# EAGLE design SparkFun_Photon_Weather_Shield (EAGLE 7.6.0)
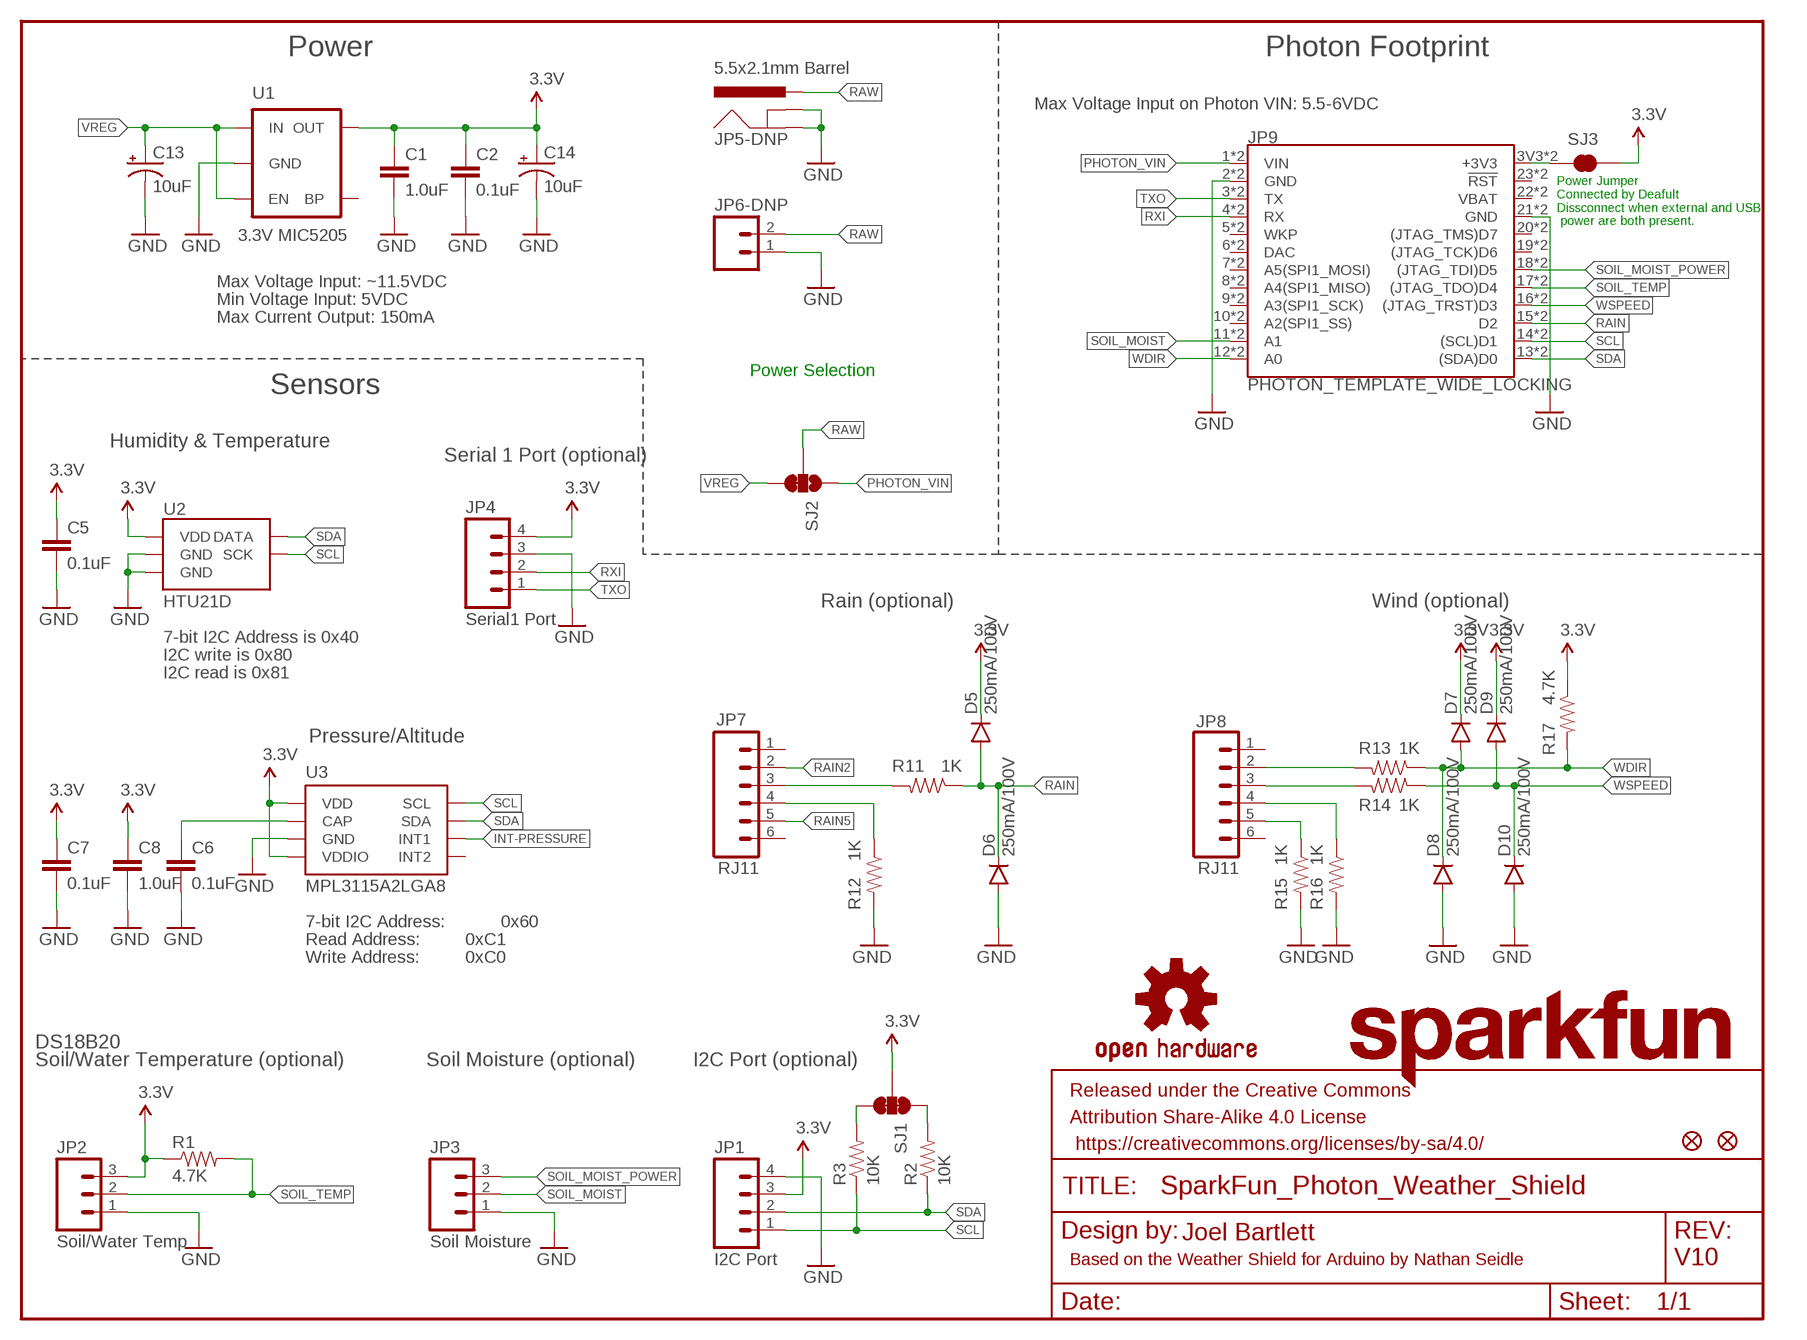
[diagram p0: schematic, sheet 1]

## Parts
C1  1.0uF  1.0UF-16V-10%(0603)  [0603-CAP]
C2  0.1uF  0.1UF-25V(+80/-20%)(0603)  [0603-CAP]
C5  0.1uF  0.1UF-25V(+80/-20%)(0603)  [0603-CAP]
C6  0.1uF  0.1UF-25V(+80/-20%)(0603)  [0603-CAP]
C7  0.1uF  0.1UF-25V(+80/-20%)(0603)  [0603-CAP]
C8  1.0uF  1.0UF-16V-10%(0603)  [0603-CAP]
C13  10uF  10UF-16V-10%(TANT)  [EIA3216]
C14  10uF  10UF-16V-10%(TANT)  [EIA3216]
D5  250mA/100V  DIODEBAS16  [SOD-323]
D6  250mA/100V  DIODEBAS16  [SOD-323]
D7  250mA/100V  DIODEBAS16  [SOD-323]
D8  250mA/100V  DIODEBAS16  [SOD-323]
D9  250mA/100V  DIODEBAS16  [SOD-323]
D10  250mA/100V  DIODEBAS16  [SOD-323]
FID1  FIDUCIAL1X2  [FIDUCIAL-1X2]
FID2  FIDUCIAL1X2  [FIDUCIAL-1X2]
FRAME1  FRAME-LETTER  [CREATIVE_COMMONS]
JP1  I2C Port  M04PTH  [1X04]
JP2  Soil/Water Temp  M03PTH  [1X03]
JP3  Soil Moisture  M03PTH  [1X03]
JP4  Serial1 Port  M04PTH  [1X04]
JP5-DNP  5.5x2.1mm Barrel  POWER_JACKSMD  [POWER_JACK_SMD]
JP6-DNP  M023.5MM  [SCREWTERMINAL-3.5MM-2]
JP7  RJ11  RJ11-6PTH  [RJ11-6]
JP8  RJ11  RJ11-6PTH  [RJ11-6]
JP9  PHOTON_TEMPLATE_WIDE_LOCKING  SPARK_PHOTONSPARK_PHOTON_TEMPLATE_WIDE_LOCKING  [SPARK_PHOTON_TEMPLATE_WIDE_LOCKING]
LOGO1  OSHW-LOGOM  [OSHW-LOGO-M]
LOGO2  SFE_LOGO_NAME.1_INCH  [SFE_LOGO_NAME_.1]
R1  4.7K  4.7KOHM-1/10W-1%(0603)  [0603-RES]
R2  10K  10KOHM-1/10W-1%(0603)0603  [0603-RES]
R3  10K  10KOHM-1/10W-1%(0603)0603  [0603-RES]
R11  1K  1KOHM-1/10W-1%(0603)  [0603-RES]
R12  1K  1KOHM-1/10W-1%(0603)  [0603-RES]
R13  1K  1KOHM-1/10W-1%(0603)  [0603-RES]
R14  1K  1KOHM-1/10W-1%(0603)  [0603-RES]
R15  1K  1KOHM-1/10W-1%(0603)  [0603-RES]
R16  1K  1KOHM-1/10W-1%(0603)  [0603-RES]
R17  4.7K  4.7KOHM-1/10W-1%(0603)  [0603-RES]
SJ1  JUMPER-PAD-3-NC_BY_TRACE  [PAD-JUMPER-3-3OF3_NC_BY_TRACE_YES_SILK_FULL_BOX]
SJ2  JUMPER-PAD-3-2OF3_NC_BY_TRACE_SMALL  [PAD-JUMPER-3-2OF3_NC_BY_TRACE_YES_SILK_FULL_BOX]
SJ3  JUMPER-PAD-2-NC_BY_TRACE  [PAD-JUMPER-2-NC_BY_TRACE_YES_SILK]
U1  3.3V MIC5205  MIC52053.3V  [SOT23-5]
U2  HTU21D  HTU21DSMD  [HTU21D]
U3  MPL3115A2LGA8  [LGA8]

## Nets
3.3V: C1.1 C2.1 C5.1 C7.1 C8.1 C14.A(+) D5.C D7.C D9.C JP1.3 JP2.3 JP4.4 R1.1 R17.1 SJ1.2 SJ3.2 U1.5(OUT) U2.VDD U3.1(VDD) U3.4(VDDIO)
GND: C1.2 C2.2 C5.2 C6.2 C7.2 C8.2 C13.C(-) C14.C(-) D6.A D8.A D10.A JP1.4 JP2.1 JP3.1 JP4.3 JP5-DNP.GND(GNDBREAK) JP5-DNP.P$4(GND) JP6-DNP.1 JP9.2(GND) JP9.21(GND) JP9.GND@0(GND) JP9.GND@2(GND) R12.2 R15.2 R16.2 U1.2(GND) U2.7(GND) U2.GND U3.3(GND)
INT-PRESSURE: U3.6(INT1)
N$1: JP8.3 R14.2
N$2: JP8.2 R13.2
N$3: R3.2 SJ1.3
N$4: JP7.3 R11.2
N$5: C6.1 U3.2(CAP)
N$6: R2.2 SJ1.1
N$7: JP9.3V3(+3V3) JP9.24(+3V3) SJ3.1
N$11: JP7.4 R12.1
N$12: JP8.5 R15.1
N$13: JP8.4 R16.1
PHOTON_VIN: JP9.1(VIN) JP9.VIN SJ2.1
RAIN: D5.A D6.C JP9.15(D2) JP9.D2 R11.1
RAIN2: JP7.2
RAIN5: JP7.5
RAW [vcc]: JP5-DNP.VIN0(PWR) JP6-DNP.2 SJ2.2
RXI: JP4.2 JP9.4(RX) JP9.RX
SCL: JP1.1 JP9.14((SCL)D1) JP9.D1((SCL)D1) R3.1 U2.SCK U3.8(SCL)
SDA: JP1.2 JP9.13((SDA)D0) JP9.D0((SDA)D0) R2.1 U2.DATA U3.7(SDA)
SOIL_MOIST: JP3.2 JP9.11(A1) JP9.A1
SOIL_MOIST_POWER: JP3.3 JP9.18((JTAG_TDI)D5) JP9.D5((JTAG_TDI)D5)
SOIL_TEMP: JP2.2 JP9.17((JTAG_TDO)D4) JP9.D4((JTAG_TDO)D4) R1.2
TXO: JP4.1 JP9.3(TX) JP9.TX
VREG: C13.A(+) SJ2.3 U1.1(IN) U1.3(EN)
WDIR: D7.A D8.C JP9.12(A0) JP9.A0 R13.1 R17.2
WSPEED: D9.A D10.C JP9.16((JTAG_TRST)D3) JP9.D3((JTAG_TRST)D3) R14.1
Unconnected: JP7.1 JP7.6 JP8.1 JP8.6 JP9.5(WKP) JP9.6(DAC) JP9.7(A5(SPI1_MOSI)) JP9.8(A4(SPI1_MISO)) JP9.9(A3(SPI1_SCK)) JP9.10(A2(SPI1_SS)) JP9.19((JTAG_TCK)D6) JP9.20((JTAG_TMS)D7) JP9.22(VBAT) JP9.23(!RST!) JP9.A2(A2(SPI1_SS)) JP9.A3(A3(SPI1_SCK)) JP9.A4(A4(SPI1_MISO)) JP9.A5(A5(SPI1_MOSI)) JP9.D6((JTAG_TCK)D6) JP9.D7((JTAG_TMS)D7) JP9.DAC JP9.RST(!RST!) JP9.VBAT JP9.WKP U1.4(BP) U3.5(INT2)

## Notes on the sheet
- Power | Photon Footprint
- Max Voltage Input on Photon VIN: 5.5-6VDC
- Power Jumper
  Connected by Deafult
  Dissconnect when external and USB
   power are both present.
- Max Voltage Input: ~11.5VDC
- Min Voltage Input: 5VDC
- Max Current Output: 150mA
- Power Selection
- Sensors
- Humidity & Temperature
- Serial 1 Port (optional)
- Rain (optional) | Wind (optional)
- 7-bit I2C Address is 0x40
- I2C write is 0x80
- I2C read is 0x81
- Pressure/Altitude
- 7-bit I2C Address: | 0x60
- Read Address: | 0xC1
- Write Address: | 0xC0
- DS18B20
- Soil/Water Temperature (optional) | Soil Moisture (optional) | I2C Port (optional)
- Joel Bartlett
- Based on the Weather Shield for Arduino by Nathan Seidle | V10

## Library data of the parts
C1 C8 = SparkFun-Capacitors:1.0UF-16V-10%(0603): CAP-00868; PROD_ID: CAP-00868
C2 C5-C7 = SparkFun-Capacitors:0.1UF-25V(+80/-20%)(0603): CAP-00810 Ceramic Standard decoupling cap; PROD_ID: CAP-00810
C13 C14 = SparkFun-Capacitors:10UF-16V-10%(TANT): CAP-00811 1206/EIA-3216 Tantalum capacitor; PROD_ID: CAP-00811
D5-D10 = SparkFun-DiscreteSemi:DIODE: Diode These are standard reverse protection diodes and small signal diodes. SMA package can handle up to about 1A. SOD-323 can handle about 200mA. What the SOD-323 package when ordering, there are some mfgs out there that are 5-pin packages.; PROD_ID: DIO-09646
FID1 FID2 = SparkFun-Aesthetics:FIDUCIAL: Fiducial Alignment Points Various fiducial points for machine vision alignment.
FRAME1 = SparkFun-Aesthetics:FRAME-LETTER: Schematic Frame Standard 8.5x11 US Letter frame
JP1 JP4 = SparkFun-Connectors:M04: Header 4 Standard 4-pin 0.1" header. Use with straight break away headers (SKU : PRT-00116), right angle break away headers (PRT-00553), swiss pins (PRT-00743), machine pins (PRT-00117), and female headers (PRT-00115). Molex polarized connector foot print use with SKU : PRT-08231 with associated crimp pins and housings. 1MM SMD Version SKU: PRT-10208
JP2 JP3 = SparkFun-Connectors:M03: Header 3 Standard 3-pin 0.1" header. Use with straight break away headers (SKU : PRT-00116), right angle break away headers (PRT-00553), swiss pins (PRT-00743), machine pins (PRT-00117), and female headers (PRT-00115). Molex polarized connector foot print use with SKU : PRT-08232 with associated crimp pins and housings.
JP5-DNP = SparkFun-Connectors:POWER_JACK: Power Jack This is the standard 5.5mm barrel jack for power. The PTH is the most common, proven, reliable, footprint. The Slot footprint only works if the mill layer is transmitted to the PCB fab house so be warned. Mating wall wart : TOL-00298 (and others); PROD_ID: CONN-08106; SF_ID: PRT-12748
JP6-DNP = SparkFun-Connectors:M02: Standard 2-pin 0.1" header. Use with - straight break away headers ( PRT-00116) - right angle break away headers (PRT-00553) - swiss pins (PRT-00743) - machine pins (PRT-00117) - female headers (PRT-00115) Molex polarized connector foot print use with: PRT-08233 with associated crimp pins and housings. 2.54_SCREWTERM for use with PRT-10571. 3.5mm Screw Terminal footprints for PRT-08084 5mm Screw Terminal footprints for use with PRT-08432; PROD_ID: CONN-08399
JP7 JP8 = SparkFun-Connectors:RJ11-6: RJ11 Jack Simple 6 pin RJ11 jack. Commonly found on CAT3 devices and Microchip programmers. SKU: PRT-00132; PROD_ID: CONN-08590
JP9 = template_temp:SPARK_PHOTON
LOGO1 = SparkFun-Aesthetics:OSHW-LOGO: Open Source Hardware Logo This logo indicates the piece of hardware it is found on incorporates a OSHW license and/or adheres to the definition of open source hardware found here: http://freedomdefined.org/OSHW
LOGO2 = SparkFun-Aesthetics:SFE_LOGO_NAME: SFE Logo, name only This is the SparkFun name logo. The logo on the schematic will always be the same size; the package variant is the height of the flame part of the logo (or the height the flame would be, if it were drawn). Default layer for the logo on the board is tSilk.
R1 R17 = SparkFun-Resistors:4.7KOHM-1/10W-1%(0603): RES-07857; PROD_ID: RES-07857
R2 R3 = SparkFun-Resistors:10KOHM-1/10W-1%(0603): RES-00824; PROD_ID: RES-00824
R11-R16 = SparkFun-Resistors:1KOHM-1/10W-1%(0603): RES-07856; PROD_ID: RES-07856
SJ1 = SparkFun-Passives:JUMPER-PAD-3-NC_BY_TRACE
SJ2 = SparkFun-Passives:JUMPER-PAD-3-2OF3_NC_BY_TRACE
SJ3 = SparkFun-Passives:JUMPER-PAD-2-NC_BY_TRACE
U1 = SparkFun-PowerIC:MIC5205: MIC5205 150mA vreg 3.3V - VREG-00822 5V - VREG-00823; PROD_ID: VREG-00822
U2 = SparkFun-Sensors:HTU21D; PROD_ID: IC-11793
U3 = SparkFun-Sensors:MPL3115A2: Altimeter/Pressure Sensor, I2C, 1.95V-3.6V supply, 50 to 110kPa; PROD_ID: IC-10869

## Net classes
0 Default: width 0.203 mm
1 vcc: width 0.203 mm

## Board
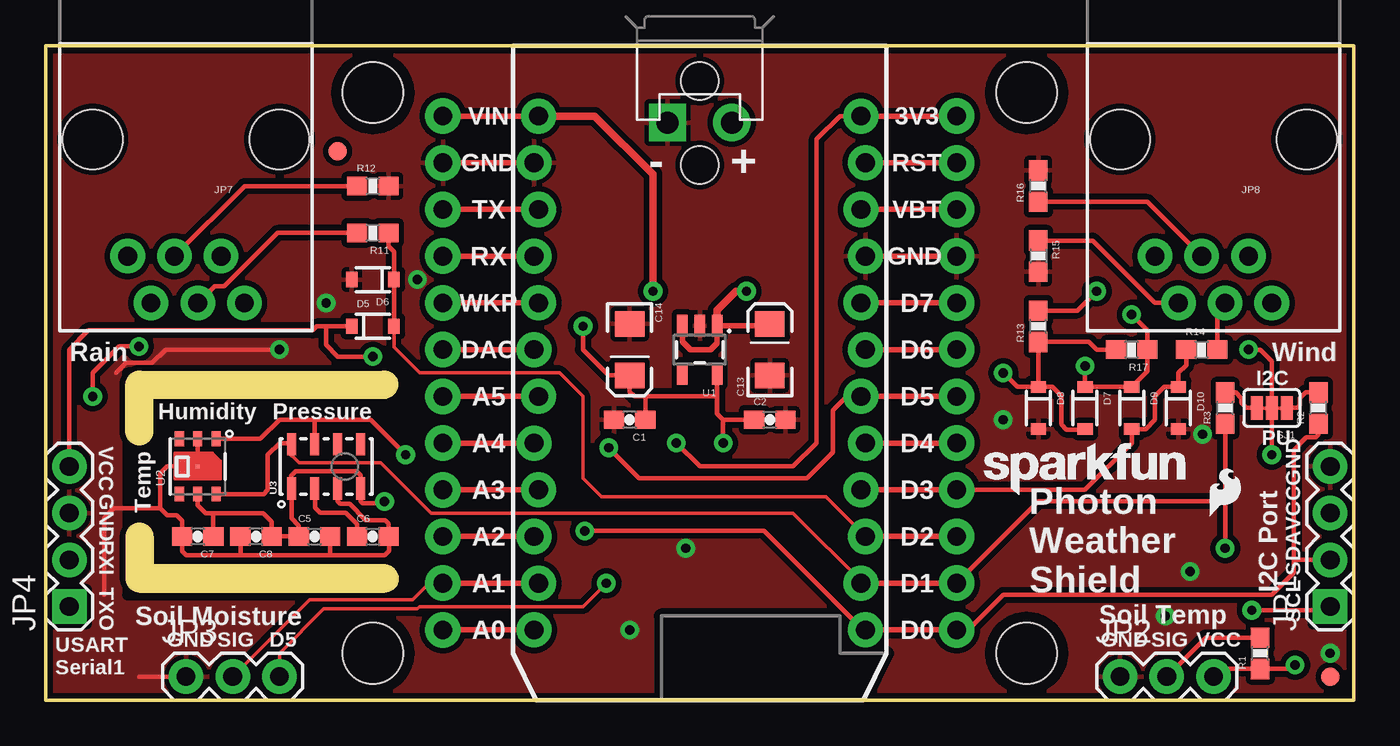
[diagram p1: board, top side]
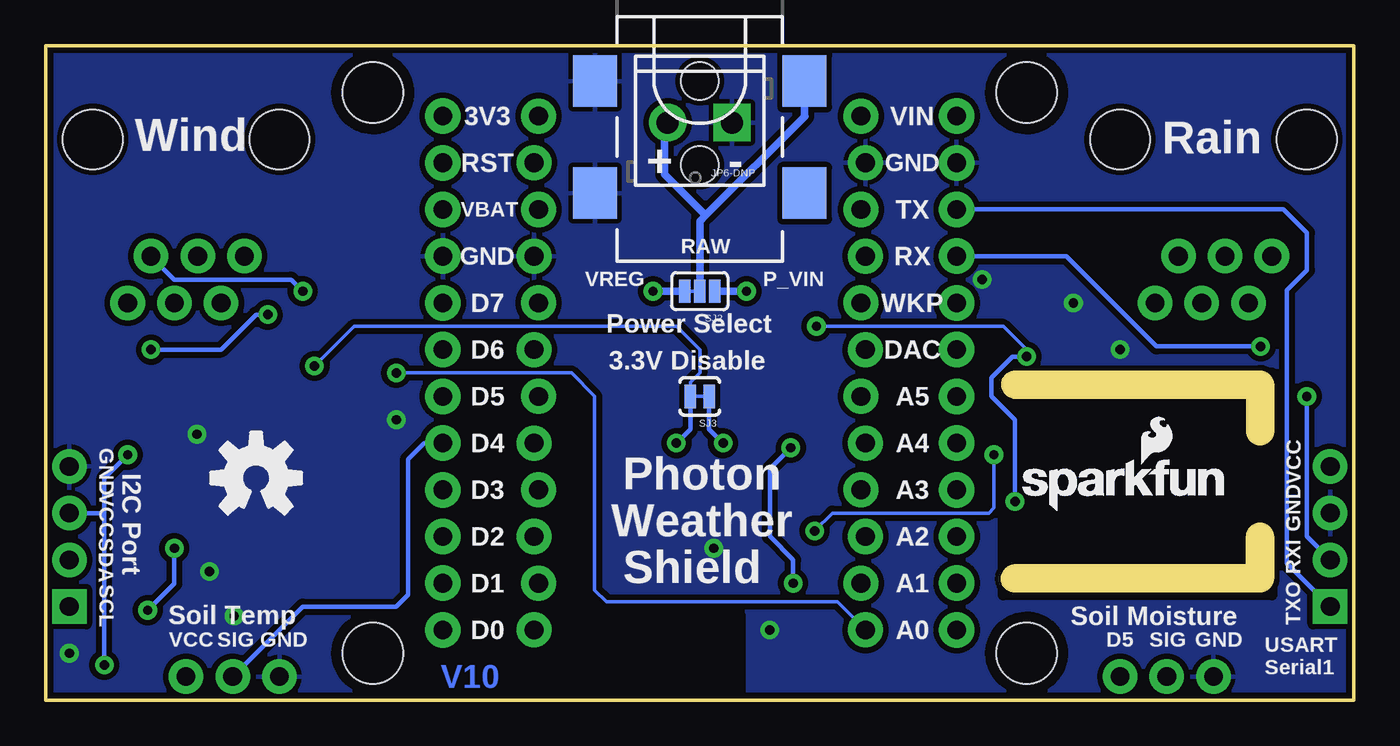
[diagram p2: board, bottom side, seen from below]

Size 71.12 x 35.56 mm. Coordinates in mm from the lower left corner, seen from the top.
Outline: 0,0 0,35.56 71.12,35.56 71.12,0 0,0
Outline: 4.39,17.09 4.39,14.63 arc90 5.08,13.95 arc90 5.74,14.61 5.74,16.46 18.36,16.46 arc90 19.07,17.17 arc90 18.44,17.8 5.11,17.8 arc90 4.39,17.09
Outline: 4.42,6.66 4.42,8.87 arc-90 5.11,9.55 arc-90 5.77,8.87 5.77,7.29 18.39,7.29 arc-90 19.1,6.58 arc-90 18.47,5.94 5.13,5.94 arc-90 4.42,6.66
Copper layers (1*16): Top 0.035mm / dielectric 1.5mm / Bottom 0.035mm
Design rules "SparkFun-2-layer": minimum track width 7mil, minimum drill 15mil, track to track 8mil, track to pad 8mil, pad to pad 8mil, via to via 8mil, smd to smd 8mil, copper to edge 8mil, drill to drill 8mil, minimum pad ring 12mil, minimum via ring 10mil, stop-mask expansion 4mil, vias tented up to drill 20mil, thermal gap 10mil
tRestrict: area 4.4,5.7 to 19.1,17.8
bRestrict: area 4.4,5.7 to 19.1,17.8
Milling: 4 lines

### Footprints (pad centres in the part's own frame; a part is rotated, then mirrored left to right if it is on the bottom)
0603-CAP = smd 1.1 x 1: 1 -0.85,0; 2 0.85,0
EIA3216 = smd 1.4 x 1.6: A 1.4,0; C -1.4,0
SOD-323 = smd 0.63 x 0.83: A 1.15,0; C -1.15,0
FIDUCIAL-1X2 = smd 1 x 1: 1 0,0
1X04 = drill 1.016 pad 1.88 square: 1 0,0 | drill 1.016 pad 1.88: 2 2.54,0; 3 5.08,0; 4 7.62,0
1X03 = drill 1.016 pad 1.88: 1 0,0; 2 2.54,0; 3 5.08,0
POWER_JACK_SMD = smd 2.8 x 2.4: GND 0,-5.7; P$4 6.1,-5.7; VIN0 0,5.7; VIN1 6.1,5.7 | hole 2.032: 0,0; 4.572,0
SCREWTERMINAL-3.5MM-2 = drill 1.2 pad 2.032 square: 1 0,0 | drill 1.2 pad 2.032: 2 3.5,0
RJ11-6 = drill 1.016 pad 1.88: 1 -3.175,8.89; 2 -1.905,6.35; 3 -0.635,8.89; 4 0.635,6.35; 5 1.905,8.89; 6 3.175,6.35 | hole 3.251: -5.08,0; 5.08,0
SPARK_PHOTON_TEMPLATE_WIDE_LOCKING = drill 1.016 pad 1.905: 1 1.397,31.75; 2 1.143,29.21; 3 1.397,26.67; 4 1.143,24.13; 5 1.397,21.59; 6 1.143,19.05; 7 1.397,16.51; 8 1.143,13.97; 9 1.397,11.43; 10 1.143,8.89; 11 1.397,6.35; 12 1.143,3.81; 13 19.177,3.81; 14 18.923,6.35; 15 19.177,8.89; 16 18.923,11.43; 17 19.177,13.97; 18 18.923,16.51; 19 19.177,19.05; 20 18.923,21.59; 21 19.177,24.13; 22 18.923,26.67; 23 19.177,29.21; 24 18.923,31.75 | drill 1.016 pad 1.93: 3V3 24.13,31.75; A0 -3.81,3.81; A1 -3.81,6.35; A2 -3.81,8.89; A3 -3.81,11.43; A4 -3.81,13.97; A5 -3.81,16.51; D0 24.13,3.81; D1 24.13,6.35; D2 24.13,8.89; D3 24.13,11.43; D4 24.13,13.97; D5 24.13,16.51; D6 24.13,19.05; D7 24.13,21.59; DAC -3.81,19.05; GND@0 -3.81,29.21; GND@2 24.13,24.13; RST 24.13,29.21; RX -3.81,24.13; TX -3.81,26.67; VBAT 24.13,26.67; VIN -3.81,31.75; WKP -3.81,21.59 | hole 3.302: -7.62,33.02; 27.94,33.02; -7.62,2.54; 27.94,2.54
0603-RES = smd 1.1 x 1: 1 -0.85,0; 2 0.85,0
PAD-JUMPER-3-3OF3_NC_BY_TRACE_YES_SILK_FULL_BOX = smd 0.635 x 1.27: 1 -0.813,0; 2 0,0; 3 0.813,0
PAD-JUMPER-3-2OF3_NC_BY_TRACE_YES_SILK_FULL_BOX = smd 0.635 x 1.27: 1 -0.813,0; 2 0,0; 3 0.813,0
PAD-JUMPER-2-NC_BY_TRACE_YES_SILK = smd 0.635 x 1.27: 1 -0.508,0; 2 0.508,0
SOT23-5 = smd 0.55 x 1.2: 1 -0.95,-1.3; 2 0,-1.3; 3 0.95,-1.3; 4 0.95,1.3; 5 -0.95,1.3
HTU21D = smd 0.2 x 0.2: 7 0,0 | smd 0.8 x 0.5: DATA 1.5,-1; GND 1.5,0; NC@1 -1.5,1; NC@6 1.5,1; SCK -1.5,-1; VDD -1.5,0
LGA8 = smd 1.2 x 0.5: 1 -1.2,1.875; 2 -1.2,0.625; 3 -1.2,-0.625; 4 -1.2,-1.875; 5 1.2,-1.875; 6 1.2,-0.625; 7 1.2,0.625; 8 1.2,1.875

### Placement (x,y rotation side)
C1  31.75,15.24 180 top
C2  39.37,15.24 0 top
C5  14.61,8.89 0 top
C6  17.78,8.89 0 top
C7  8.26,8.89 180 top
C8  11.43,8.89 180 top
C13  39.37,19.05 90 top
C14  31.75,19.05 270 top
D5  17.78,20.32 0 top
D6  17.78,22.86 180 top
D7  56.52,15.88 270 top
D8  53.98,15.88 270 top
D9  59.05,15.88 270 top
D10  61.59,15.88 270 top
FID1  69.85,1.27 0 top
FID2  15.88,29.84 0 top
FRAME1  7.62,-10.16 0 top  (outside the outline)
JP1  69.85,5.08 90 top
JP2  58.42,1.27 0 top
JP3  7.62,1.27 0 top
JP4  1.27,5.08 90 top
JP5-DNP  35.56,33.66 270 bottom
JP6-DNP  33.81,31.39 180 bottom
JP7  7.62,30.48 180 top
JP8  63.5,30.48 180 top
JP9  25.4,0 0 top
LOGO1  59.69,12.06 0 bottom
LOGO2  50.55,10.67 0 top
R1  66.04,2.54 90 top
R2  69.22,15.88 90 top
R3  64.14,15.88 90 top
R11  17.78,25.4 180 top
R12  17.78,27.94 0 top
R13  53.98,20.32 90 top
R14  62.87,19.05 0 top
R15  53.98,24.13 270 top
R16  53.98,27.94 90 top
R17  59.05,19.05 180 top
SJ1  66.67,15.88 180 top
SJ2  35.56,22.23 180 bottom
SJ3  35.56,16.51 180 bottom
U1  35.56,19.05 180 top
U2  8.26,12.7 90 top
U3  15.24,12.7 90 top
U$1  [SFE_LOGO_NAME_FLAME_.1]  18.41,10.19 0 bottom
U$3  [SFE_LOGO_FLAME_.1]  62.99,9.65 0 top

### Tracks (layer width: path | path; a pad name or v marks a point on that pad's centre or on a via)
3.3V  (via drill 0.51)
  Top 0.254: U2.VDD 8.26,10.59 8.69,10.16 9.11,10.16 | C7.1 9.11,9.18 | 9.11,10.16 C7.1 | U3.4 17.11,12.22 16.89,12.45 13.59,12.45 13.34,12.19 13.34,11.53 U3.1 13.37,9.88 13.76,9.49 C5.1 C8.1 12.28,9.69 11.81,10.16 9.11,10.16 | JP2.3 63.92,1.69 R1.1 67.73,1.69 v67.94,1.91 | 38.56,15.2 C2.1 36.83,15.24 | v56.52,18.16 D7.C D9.C 59.91,17.88 R17.1 59.91,20.11 v59.05,20.95 | v66.67,13.34 SJ1.2 66.67,18.41 66.04,19.05 v65.41,19.05 | 36.51,16.51 32.6,16.51 | 32.6,16.51 C1.1 | 32.6,16.51 32,16.51 31.75,16.76 C14.A 30.61,17.65 29.21,19.05 v29.21,20.32 | U1.5 36.51,16.51 | 36.51,16.51 36.51,15.56 36.83,15.24 | v36.83,13.97 36.83,15.24 | C7.1 9.11,9.74 | 17.14,11.47 U3.4 | v17.78,18.67 15.88,18.67 15.24,19.3 15.24,20.32 | U3.4 17.11,10.8 17.22,10.69 18.31,10.69 v18.41,10.79 | JP4.4 1.27,19.05 2.31,20.09 14.5,20.09 14.73,20.32 15.24,20.32 | D5.C 15.24,20.32
  Bottom 0.203: SJ3.2 36.07,17.27 35.56,17.78 35.56,19.05 36.83,20.32 54.36,20.32 v56.52,18.16 | v29.21,20.32 19.05,20.32 17.78,19.05 v17.78,18.67
  Bottom 0.254: v67.94,1.91 67.94,10.16 | 67.94,10.16 67.94,12.06 v66.67,13.34 | JP1.3 67.94,10.16 | v65.41,19.05 61.59,19.05 59.69,20.95 v59.05,20.95 | SJ3.2 36.07,14.73 v36.83,13.97 | v18.41,10.79 18.41,15.24 19.68,16.51 19.68,17.53 18.54,18.67 v17.78,18.67
GND  (via drill 0.51)
  Top 0.254: U3.3 15.87,10.8 16,10.67 16.51,10.67 17.4,9.78 18.44,9.78 18.63,9.59 C6.2 18.67,8.85 18.67,8.13 18.41,7.87 15.46,7.87 | 10.58,7.87 7.62,7.87 7.41,8.09 C7.2 7.41,9.74 7.11,10.03 6.6,10.03 6.22,10.41 | 10.58,7.87 15.46,7.87 | C5.2 15.46,7.87 | C8.2 10.58,7.87 | 6.22,10.41 6.22,12.32 6.6,12.7 U2.7 U2.GND | 6.22,10.41 3.68,10.41 3.17,9.91 3.17,5.71 | v12.7,19.05 6.5,19.05 5.79,18.34 4.37,18.34 3.81,17.78 | JP3.1 5.08,1.27
  other vias: 52.07,15.24 69.85,2.54 62.92,14.45 60.88,4.57 62.23,6.99 15.24,21.59 20.19,22.86 31.75,3.81 34.8,8.26
  pour Bottom (isolate 0.305): 0,0 0,35.56 71.12,35.56 71.12,0
  pour Top (isolate 0.305): 0,0 0,35.56 71.12,35.56 71.12,0
N$1
  Top 0.254: R14.2 63.72,21.17 JP8.3
N$2  (via drill 0.51)
  Top 0.254: R13.2 56.09,21.17 v57.15,22.23
  Bottom 0.254: JP8.2 64.14,22.86 57.78,22.86 v57.15,22.23
N$3
  Top 0.254: R3.2 64.71,16.73 65.02,16.41 65.02,16.15 65.28,15.9 65.84,15.9 SJ1.3
N$4
  Top 0.254: JP7.3 9.16,22.5 9.7,22.5 12.6,25.4 R11.2
N$5
  Top 0.254: 16.93,9.36 C6.1 16.93,9.56 16.31,10.19 14.91,10.19 14.63,10.46 14.63,11.46 14.61,11.49 U3.2
N$6
  Top 0.254: R2.2 68.52,16.73 68.2,16.41 68.2,16.03 68.07,15.9 67.51,15.9 SJ1.1
N$7  (via drill 0.51)
  Top 0.254: v34.29,13.97 35.56,12.7 40.64,12.7 41.91,13.97 41.91,30.48 43.18,31.75 JP9.24 44.45,31.75
  Bottom 0.254: SJ3.1 35.05,14.73 v34.29,13.97
N$11
  Top 0.254: JP7.4 10.79,27.94 R12.1
N$12
  Top 0.254: JP8.5 60.33,21.59 56.94,24.98 R15.1
N$13
  Top 0.254: JP8.4 59.91,27.09 R16.1
PHOTON_VIN  (via drill 0.51)
  Top 0.254: JP9.1 26.67,31.75
  Top 0.406: v33.02,22.23 33.02,28.57 29.84,31.75 JP9.1
  Bottom 0.406: SJ2.1 v33.02,22.23
RAIN
  Top 0.203: D5.A 18.93,19.17 20.32,17.78 27.94,17.78 29.21,16.51 29.21,12.06 30.23,11.05 42.42,11.05 JP9.15 44.45,8.89
  Top 0.254: D5.A D6.C 18.92,24.38 18.63,24.68 R11.1
RAW
  Bottom 0.406: JP6-DNP.2 37.47,31.24 37.47,28.57 35.24,26.35 | JP5-DNP.VIN0 29.86,31.77 29.84,31.75 35.24,26.35 | 35.24,26.35 35.56,26.04 SJ2.2
RXI  (via drill 0.51)
  Top 0.203: JP9.4 26.67,24.13
  Top 0.254: v2.54,16.51 2.54,17.78 3.99,19.23 v5.05,19.23
  Bottom 0.254: JP4.2 2.54,8.89 v2.54,16.51 | v5.05,19.23 10.72,19.23 15.62,24.13 JP9.RX
SCL  (via drill 0.51)
  Top 0.203: 13.37,13.3 13.77,12.9 18.21,12.9 20.95,10.16 40.64,10.16 44.45,6.35 JP9.14
  Top 0.254: U2.SCK 11.84,11.2 12.06,11.43 12.06,13.34 12.7,13.97 13.29,13.97 U3.8 13.37,13.3 | JP1.1 69.65,4.88 v65.58,4.88 | 64.14,10.79 53.98,10.79 JP9.D1 | v64.14,8.26 64.14,10.79 | 64.14,10.79 R3.1
  Bottom 0.254: v64.14,8.26 64.14,6.33 v65.58,4.88
SDA  (via drill 0.51)
  Top 0.254: U2.DATA 11.66,14.2 12.7,15.24 14.61,15.24 | U3.7 14.61,13.91 14.61,15.24 | JP1.2 67.87,7.62 | R2.1 69.22,14.43 69.06,14.28 68.56,14.28 67.87,13.59 67.87,7.62 | 67.87,7.62 67.87,6.91 66.67,5.71 52.07,5.71 50.16,3.81 JP9.D0 | v29.31,9.2 39.04,9.2 44.42,3.81 44.45,3.81 JP9.13 | v19.56,13.34 17.65,15.24 14.61,15.24
  Bottom 0.203: v29.31,9.2 28.35,10.16 19.84,10.16 19.56,10.44 v19.56,13.34
SOIL_MOIST
  Top 0.203: JP3.2 14.35,5.46 19.94,5.46 20.83,6.35 JP9.A1 | 26.67,6.35 JP9.11
SOIL_MOIST_POWER  (via drill 0.51)
  Top 0.203: v30.48,6.35 29.21,5.08 20.32,5.08 20.19,4.95 15.11,4.95 12.7,2.54 JP3.3
  Top 0.254: v30.61,13.72 32.26,12.06 41.4,12.06 42.8,13.46 42.8,15.75 43.56,16.51 JP9.18 44.45,16.51
  Bottom 0.254: v30.61,13.72 31.75,12.57 31.75,8.89 30.48,7.62 v30.48,6.35
SOIL_TEMP
  Top 0.254: R1.2 63.08,3.39 JP2.2 | JP9.17 44.45,13.97
  Bottom 0.254: JP2.2 57.15,5.08 52.07,5.08 51.44,5.71 51.44,13.08 50.55,13.97 JP9.D4
TXO
  Top 0.203: 26.67,26.67 JP9.3
  Bottom 0.254: JP4.1 3.63,7.44 3.63,22.28 2.54,23.37 2.54,25.4 3.81,26.67 JP9.TX
VREG  (via drill 0.51)
  Top 0.305: C13.A 39.27,20.35 U1.1 36.5,19.41 36.14,19.05 35.05,19.05 34.61,19.49 U1.3
  Top 0.406: v38.1,22.23 37.54,22.23 36.5,21.18 U1.1
  Bottom 0.406: SJ2.3 v38.1,22.23
WDIR  (via drill 0.51)
  Top 0.203: JP9.12 26.67,3.81
  Top 0.254: v52.07,17.78 52.83,17.02 D8.C | D7.A 56.5,14.71 55.5,14.71 55.22,14.99 55.22,16.54 54.73,17.02 D8.C | R17.2 57.15,19.05 56.73,19.47 R13.1 D8.C | D8.C
  Bottom 0.203: v52.07,17.78 42.55,17.78 41.27,16.51 41.27,5.97 40.64,5.33 28.07,5.33 JP9.12
WSPEED
  Top 0.203: 44.45,11.43 JP9.16
  Top 0.254: R14.1 62.02,18.2 61.59,17.78 D10.C 60.84,17.02 60.33,16.51 60.33,15.24 59.81,14.72 D9.A 59.05,13.97 56.52,11.43 JP9.D3

### Text on the board
Bottom: V10
Dimension: Route Out | Route Out
tPlace: - | + | Rain | Wind | I2C | Humidity | Pressure | VCC | PU | GND | GND | Temp | RXI | VCC | SDA | TXO | Photon / Weather / Shield | I2C Port | Soil Moisture | Soil Temp | SCL | GND | SIG | D5 | GND | SIG | VCC | USART / Serial1
bPlace: Rain | Wind | - | + | RAW | P_VIN | VREG | Power Select | 3.3V Disable | GND | VCC | I2C Port | Photon | VCC | GND | Weather | SDA | RXI | Shield | SCL | TXO | Soil Moisture | Soil Temp | GND | SIG | D5 | GND | SIG | VCC | USART / Serial1
tDocu: Joel Bartlett